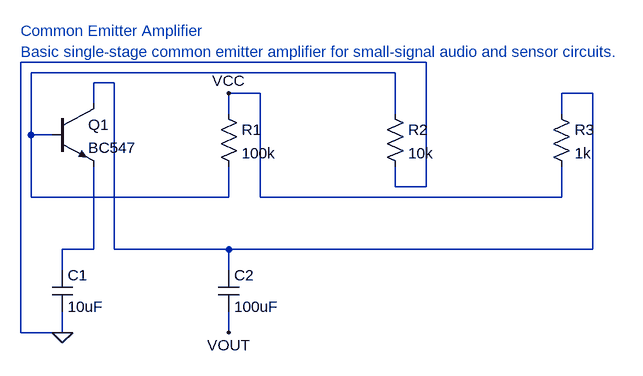
[diagram p0: schematic common_emitter_amplifier.asc]
common_emitter_amplifier.asc, the LTspice schematic file:
Version 4
SHEET 1 1200 800
TEXT 16 16 Left 2 ;Common Emitter Amplifier
TEXT 16 48 Left 2 ;Basic single-stage common emitter amplifier for small-signal audio and sensor circuits.
SYMBOL npn 64 128 R0
SYMATTR InstName Q1
SYMATTR Value BC547
SYMBOL res 320 128 R0
SYMATTR InstName R1
SYMATTR Value 100k
SYMBOL res 576 128 R0
SYMATTR InstName R2
SYMATTR Value 10k
SYMBOL res 832 128 R0
SYMATTR InstName R3
SYMATTR Value 1k
SYMBOL cap 64 384 R0
SYMATTR InstName C1
SYMATTR Value 10uF
SYMBOL cap 320 384 R0
SYMATTR InstName C2
SYMATTR Value 100uF
FLAG 336 112 VCC
WIRE 336 112 336 144
WIRE 336 112 384 112
WIRE 384 112 384 272
WIRE 384 272 848 272
WIRE 848 224 848 256
WIRE 848 256 848 272
WIRE 32 80 32 176
WIRE 32 80 592 80
WIRE 32 176 32 272
WIRE 32 176 64 176
WIRE 32 272 336 272
WIRE 336 224 336 256
WIRE 336 256 336 272
WIRE 592 80 592 112
WIRE 592 112 592 144
FLAG 80 480 0
WIRE 16 64 16 480
WIRE 16 64 640 64
WIRE 16 480 80 480
WIRE 80 448 80 480
WIRE 592 224 592 256
WIRE 592 256 640 256
WIRE 640 64 640 256
WIRE 128 96 128 128
WIRE 128 96 160 96
WIRE 160 96 160 352
WIRE 160 352 336 352
WIRE 336 352 336 384
WIRE 336 352 896 352
WIRE 848 112 848 144
WIRE 848 112 896 112
WIRE 896 112 896 352
WIRE 80 352 80 384
WIRE 80 352 128 352
WIRE 128 224 128 256
WIRE 128 256 128 352
FLAG 336 480 VOUT
WIRE 336 448 336 480

The netlist it stands for:
* common_emitter_amplifier.asc
Q1 N002 N001 N003 0 BC547
R1 VCC N001 100k
R2 N001 0 10k
R3 N002 VCC 1k
C1 N003 0 10uF
C2 N002 VOUT 100uF
.model NPN NPN
.model PNP PNP
.lib standard.bjt
* Common Emitter Amplifier
* Basic single-stage common emitter amplifier for small-signal audio and sensor circuits.
.backanno
.end